# EAGLE design Serial_CAN_Bus_V1.3 (EAGLE 6.4)
DESCRIPTION: microOBD 200 OBD-II Module; HW_REV: 1.4; PCB_REV: C; PCB_SPEC1: Layer Count: 4; PCB_SPEC2: Size: 1.3" x 0.59"; PCB_SPEC3: Finish Thickness: 0.049" - 0.052"; PCB_SPEC4: Copper Weight: 1oz; TITLE: STM1120

## Sheet 1 of 2
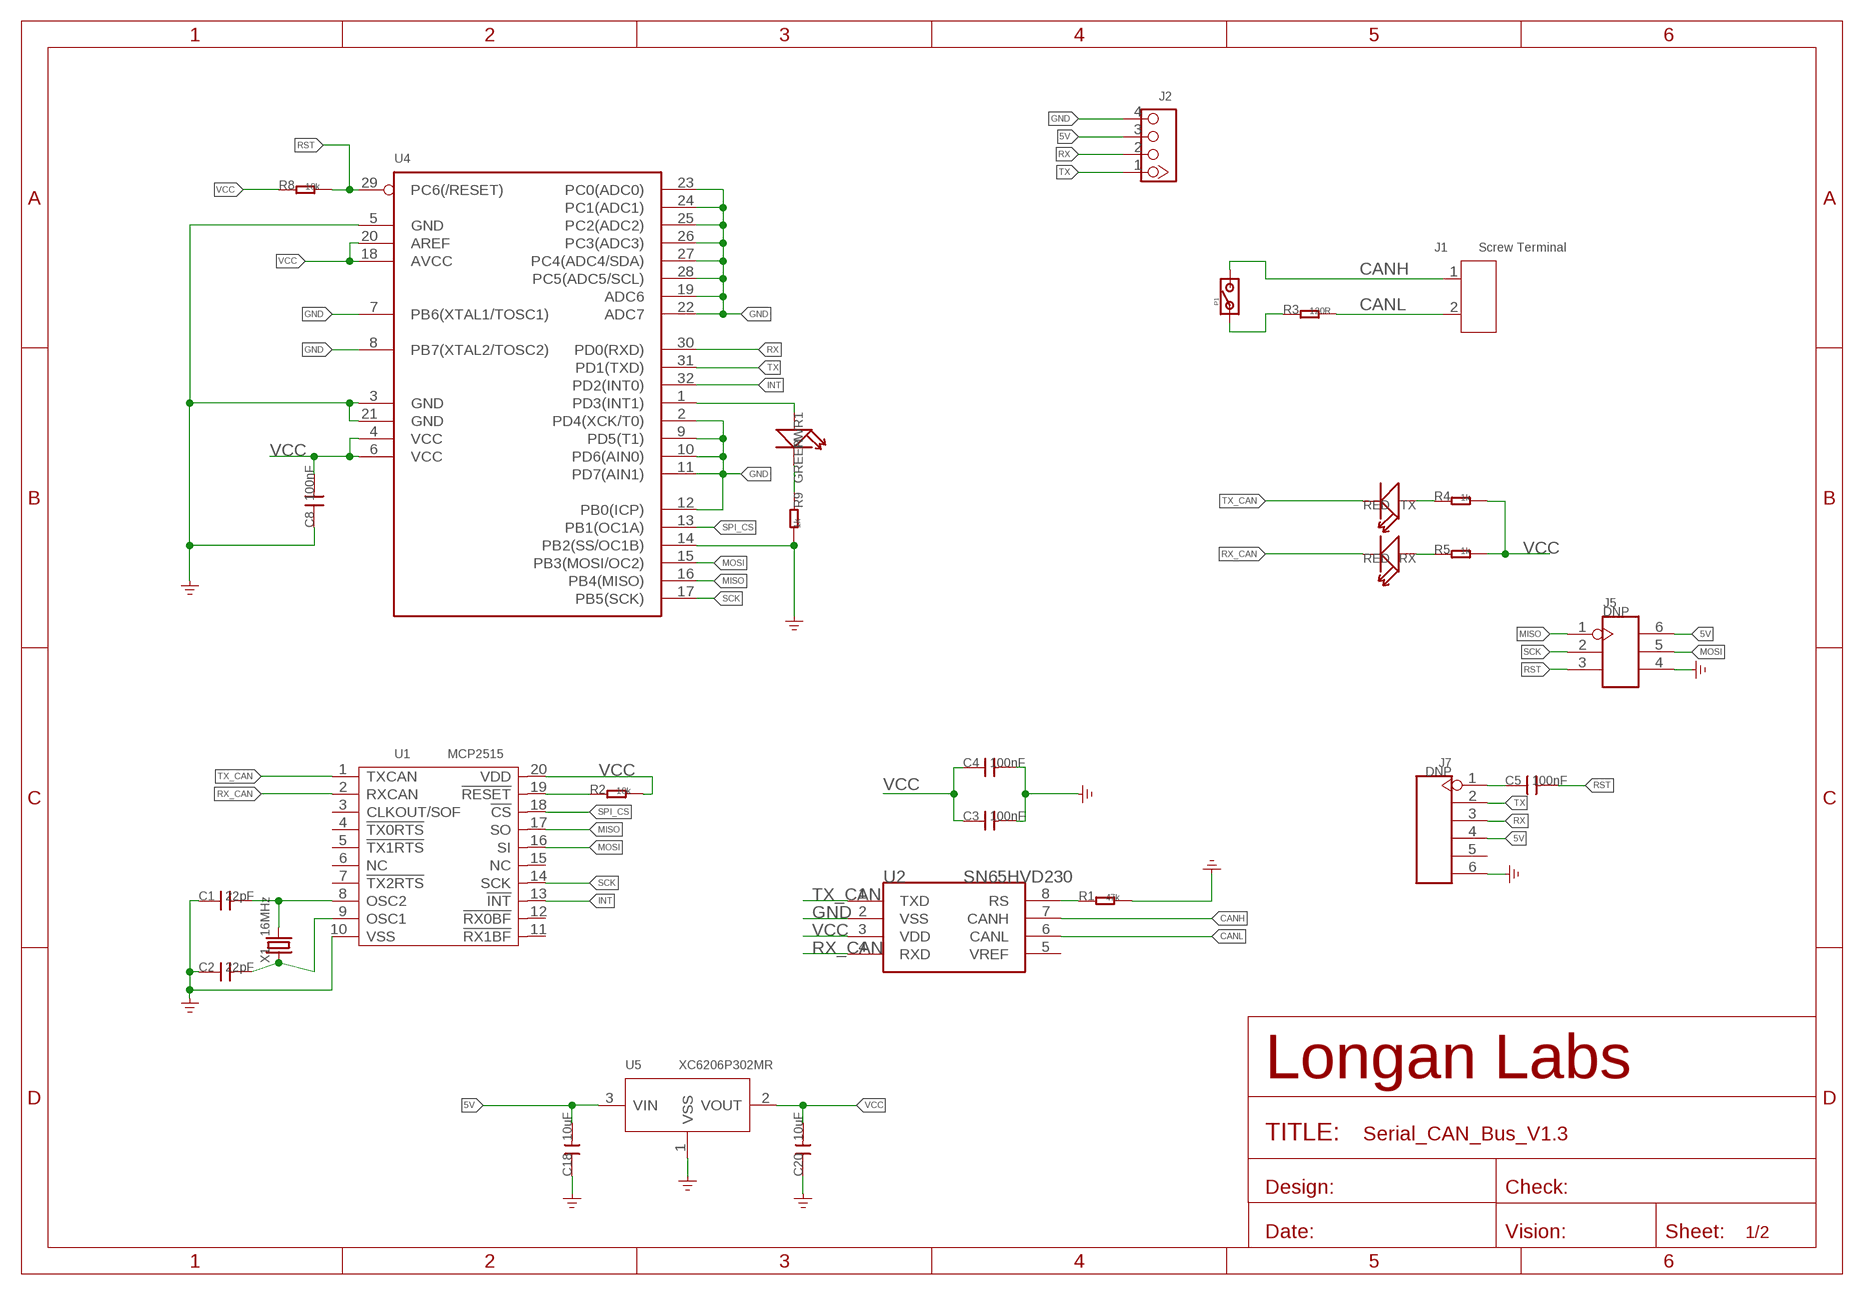
[diagram p0: schematic, sheet 1]

### Parts
C1  22pF  C-0603  [0603]
C2  22pF  C-0603  [0603]
C3  100nF  C-0603  [0603]
C4  100nF  C-0603  [0603]
C5  100nF  C-0603  [0603]
C8  100nF  C-0603  [0603]
C18  10uF  CAP-0603  [C0603]
C20  10uF  CAP-0603  [C0603]
J1  Screw Terminal  SCREW-TERMINAL-2P'3.5'  [2P-3.5]
J2  320110033  GROVE-CONNECTOR-DIP-2.0  [HW4-2.0]
J5  DNP  HEADER-2X3P-2.0-1.143  [H2X3-SMD-2.0(1.143)]
J7  DNP  HEADER-6P-55/35MIL  [H6-2.54]
P1  PAD-JUMPER-2P  [2P-SMD-1.78X1.27]
PWR1  GREEN  LED'0603'  [LED-0603]
R1  47k  R-0603  [0603]
R2  10k  R-0603  [0603]
R3  120R  R-0603  [0603]
R4  1k  R-0603  [0603]
R5  1k  R-0603  [0603]
R8  10k  R-0603  [0603]
R9  1k  R-0603  [0603]
RX  RED  LED'0603'  [LED-0603]
TX  RED  LED'0603'  [LED-0603]
U1  MCP2515  MCP2515'ST'  [TSSOP20-0.65-6.5X4.4MM]
U2  SN65HVD230  MCP2551-SOIC8  [SOIC8-6.0]
U4  MCU-ATMEGA8/168/328'AU'  [TQFP32-0.8-7X7MM]
U5  XC6206P302MR  PMIC-XC6206PMR  [SOT-23]
X1  16MHz  CRYSTAL-2P'HC49US'  [HC49US]

### Nets
5V: C18.2 J2.3 J5.6 J7.4 U5.3(VIN)
CANH: J1.1 P1.2 U2.7(CANH)
CANL: J1.2 R3.2 U2.6(CANL)
GND: C1.1 C2.1 C3.2 C4.2 C8.1 C18.1 C20.1 J2.4 J5.4 J7.6 R1.2 R9.2 U1.10(VSS) U2.2(VSS) U4.2(PD4(XCK/T0)) U4.3(GND) U4.5(GND) U4.7(PB6(XTAL1/TOSC1)) U4.8(PB7(XTAL2/TOSC2)) U4.9(PD5(T1)) U4.10(PD6(AIN0)) U4.11(PD7(AIN1)) U4.12(PB0(ICP)) U4.14(PB2(SS/OC1B)) U4.19(ADC6) U4.21(GND) U4.22(ADC7) U4.23(PC0(ADC0)) U4.24(PC1(ADC1)) U4.25(PC2(ADC2)) U4.26(PC3(ADC3)) U4.27(PC4(ADC4/SDA)) U4.28(PC5(ADC5/SCL)) U5.1(VSS) ; supply symbol labelled GND_POWER
INT: U1.13(!INT) U4.32(PD2(INT0))
MISO: J5.1 U1.17(SO) U4.16(PB4(MISO))
MOSI: J5.5 U1.16(SI) U4.15(PB3(MOSI/OC2))
N$1: P1.1 R3.1
N$2: R4.1 TX.+
N$5: C5.1 J7.1
N$6: PWR1.+ U4.1(PD3(INT1))
N$7: PWR1.- R9.1
N$15: R5.1 RX.+
N$16: C1.2 U1.8(OSC2) X1.2
N$17: C2.2 U1.9(OSC1) X1.1
N$20: R1.1 U2.8(RS)
RST: C5.2 J5.3 R8.2 U4.29(PC6(/RESET))
RST_N: R2.1 U1.19(!RESET)
RX: J2.2 J7.3 U4.30(PD0(RXD))
RX_CAN: RX.- U1.2(RXCAN) U2.4(RXD)
SCK: J5.2 U1.14(SCK) U4.17(PB5(SCK))
SPI_CS: U1.18(!CS) U4.13(PB1(OC1A))
TX: J2.1 J7.2 U4.31(PD1(TXD))
TX_CAN: TX.- U1.1(TXCAN) U2.1(TXD)
VCC: C3.1 C4.1 C8.2 C20.2 R2.2 R4.2 R5.2 R8.1 U1.20(VDD) U2.3(VDD) U4.4(VCC) U4.6(VCC) U4.18(AVCC) U4.20(AREF) U5.2(VOUT)
Unconnected: J7.5 U1.3(CLKOUT/SOF) U1.4(!TX0RTS) U1.5(!TX1RTS) U1.6(NC) U1.7(!TX2RTS) U1.11(!RX1BF) U1.12(!RX0BF) U1.15(NC) U2.5(VREF)

## Sheet 2 of 2

## Library data of the parts
C1-C5 C8 = Discrete:C*: Ceramic Capacitors
C18 C20 = Discrete-new:CAP: Ceramic Capacitors
J1 = Connector-new:SCREW-TERMINAL-2P: 2P-3.5:320110028;2P-5.0:320110031
J2 = Connector-new:GROVE-CONNECTOR-DIP: 4P-2.0:320110033;4P-2.0-90D:320110034
J5 = Connector-new:HEADER-2X3P
J7 = Connector-new:HEADER-6P
P1 = Discrete:PAD-JUMPER-2P
PWR1 RX TX = Discrete:LED*
R1-R5 R8 R9 = Discrete:R*
U1 = Heilight:MCP2515
U2 = IC:MCP2551: High-Speed CAN Transceiver http://ww1.microchip.com/downloads/en/devicedoc/21667f.pdf
U4 = IC-new:MCU-ATMEGA8/168/328
U5 = IC-new:PMIC-XC6206P: LOW ESR Cap.Compatible Positive Voltage Regulators
X1 = Discrete-new:CRYSTAL-2P

## Net classes
3 usbvcc: width 0.152 mm, drill 0.152 mm, clearance 0.152 mm

## Board
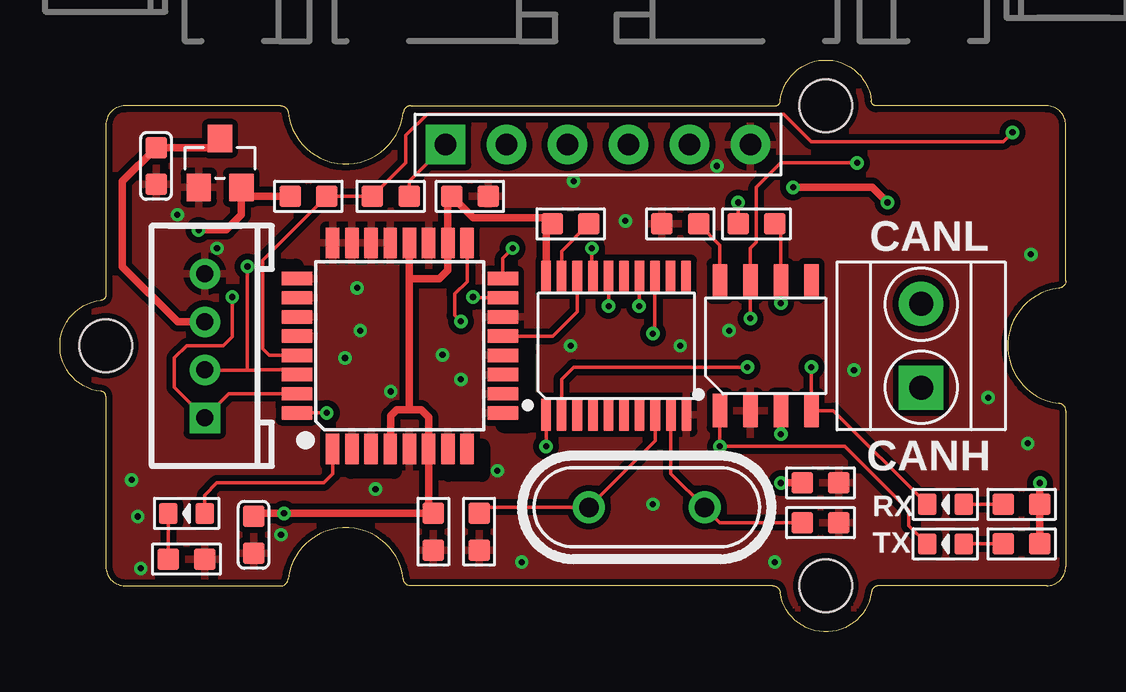
[diagram p1: board, top side]
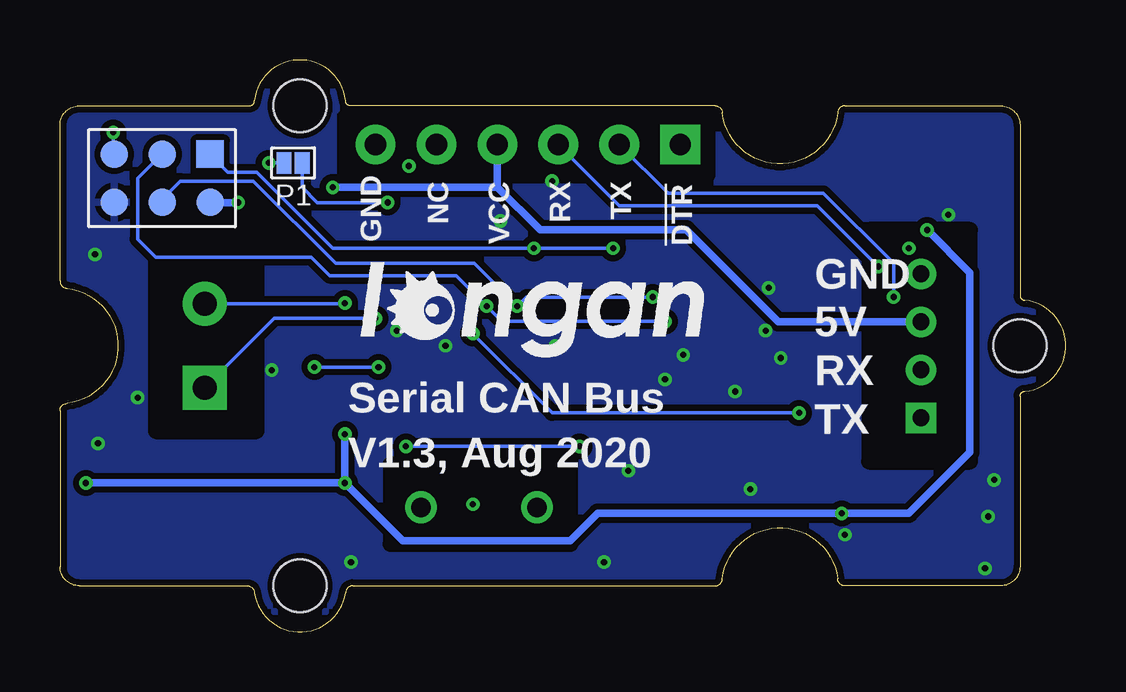
[diagram p2: board, bottom side, seen from below]

Size 41.91 x 23.83 mm. Coordinates in mm from the lower left corner, seen from the top.
Copper layers (1*16): Top 0.035mm / dielectric 1.5mm / Bottom 0.035mm
Design rules "SeeedStudio_2layer_DRU_no_angle_20140221 *": minimum track width 6mil, minimum drill 10mil, track to track 6mil, track to pad 6mil, pad to pad 6mil, via to via 6mil, smd to smd 0mil, copper to edge 10mil, drill to drill 10mil, minimum pad ring 10mil, minimum via ring 6mil, stop-mask expansion 2mil, vias tented up to drill 25mil, thermal gap 10mil
tRestrict: area 9.2,12.3 to 9.8,15.2; area 18.5,8.6 to 19.5,11.7; area 16.2,6.6 to 17.6,7.7; area 12.1,6.7 to 13.9,7.6
bRestrict: area 4,7.1 to 8.2,16.7; area 33.7,8.4 to 37.9,15.4; area 20.6,3.7 to 28.1,7; area 14.9,19 to 30,21.4

### Footprints (pad centres in the part's own frame; a part is rotated, then mirrored left to right if it is on the bottom)
0603 = smd 0.889 x 0.889: 1 -0.762,0; 2 0.762,0
C0603 = smd 0.889 x 0.889: 1 -0.762,0; 2 0.762,0
2P-3.5 = drill 1 pad 1.85 square: 1 -1.75,0 | drill 1 pad 1.85: 2 1.75,0
HW4-2.0 = drill 0.7 pad 1.27 square: 1 -3,0 | drill 0.7 pad 1.27: 2 -1,0; 3 1,0; 4 3,0
H2X3-SMD-2.0(1.143) = smd 1.143 x 1.143: 1 -1,2; 2 -1,0; 3 -1,-2; 4 1,-2; 5 1,0; 6 1,2
H6-2.54 = drill 0.889 pad 1.651 square: 1 0,6.35 | drill 0.889 pad 1.651: 2 0,3.81; 3 0,1.27; 4 0,-1.27; 5 0,-3.81; 6 0,-6.35
2P-SMD-1.78X1.27 = smd 0.889 x 0.61: 1 0,0.381; 2 0,-0.381
LED-0603 = smd 0.762 x 0.889: + -0.762,0; - 0.762,0
TSSOP20-0.65-6.5X4.4MM = smd 0.4 x 1.35: 1 -2.925,-2.875; 2 -2.275,-2.875; 3 -1.625,-2.875; 4 -0.975,-2.875; 5 -0.325,-2.875; 6 0.325,-2.875; 7 0.975,-2.875; 8 1.625,-2.875; 9 2.275,-2.875; 10 2.925,-2.875; 11 2.91,2.875; 12 2.26,2.875; 13 1.61,2.875; 14 0.96,2.875; 15 0.325,2.875; 16 -0.325,2.875; 17 -0.975,2.875; 18 -1.625,2.875; 19 -2.275,2.875; 20 -2.925,2.875
SOIC8-6.0 = smd 0.6 x 1.4: 1 -1.905,-2.7; 2 -0.635,-2.7; 3 0.635,-2.7; 4 1.905,-2.7; 5 1.905,2.7; 6 0.635,2.7; 7 -0.635,2.7; 8 -1.905,2.7
GROVE-TEST-PLATFORM = hole 2.2: -10,-10; -10,10; 20,0
TQFP32-0.8-7X7MM = smd 1.27 x 0.559: 1 -4.293,2.8; 2 -4.293,2; 3 -4.293,1.2; 4 -4.293,0.4; 5 -4.293,-0.4; 6 -4.293,-1.2; 7 -4.293,-2; 8 -4.293,-2.8; 17 4.293,-2.8; 18 4.293,-2; 19 4.293,-1.2; 20 4.293,-0.4; 21 4.293,0.4; 22 4.293,1.2; 23 4.293,2; 24 4.293,2.8 | smd 0.559 x 1.27: 9 -2.8,-4.293; 10 -2,-4.293; 11 -1.2,-4.293; 12 -0.4,-4.293; 13 0.4,-4.293; 14 1.2,-4.293; 15 2,-4.293; 16 2.8,-4.293; 25 2.8,4.293; 26 2,4.293; 27 1.2,4.293; 28 0.4,4.293; 29 -0.4,4.293; 30 -1.2,4.293; 31 -2,4.293; 32 -2.8,4.293
SOT-23 = smd 1.016 x 1.143: 1 -0.889,-1.016; 2 0.889,-1.016; 3 0,1.016
HC49US = drill 0.813: 1 -2.413,0; 2 2.413,0

### Placement (x,y rotation side)
C1  17.46,4.17 90 top
C2  31.69,4.56 180 top
C3  31.69,6.21 0 top
C4  17.08,18.14 0 top
C5  13.78,18.14 180 top
C8  15.56,4.17 90 top
C18  4,19.41 90 top
C20  8.07,4.05 90 top
J1  35.88,11.92 90 top
J2  6.03,11.92 90 top
J5  37.66,18.91 270 bottom
J7  22.42,20.3 90 top
P1  32.2,19.54 270 bottom
PWR1  5.27,4.94 180 top
R1  25.85,17 180 top
R2  21.27,17 180 top
R3  29.02,17 0 top
R4  40.07,3.67 0 top
R5  40.07,5.32 0 top
R8  10.35,18.14 0 top
R9  5.27,3.03 0 top
RX  36.89,5.32 180 top
TX  36.89,3.67 180 top
U1  23.18,11.92 0 top
U2  29.4,11.92 0 top
U3  [GROVE-TEST-PLATFORM]  21.91,11.92 180 top
U4  14.16,11.92 90 top
U5  6.67,19.54 0 top
U$5  [LONGAN-SILK-SMALLER]  30.67,10.27 0 bottom
X1  24.45,5.19 180 top

### Tracks (layer width: path | path; a pad name or v marks a point on that pad's centre or on a via)
5V  (via drill 0.25 pad 0.51)
  Top 0.305: U5.3 6.29,20.18 C18.2 2.6,18.78 2.6,15.22 4.91,12.92 J2.3 | v30.54,18.53 33.85,18.53 v34.48,17.89
  Bottom 0.305: J2.3 11.99,12.92 15.81,16.75 21.91,16.75 23.69,18.53 | 23.69,18.53 J7.4 | 23.69,18.53 v30.54,18.53 | v34.48,17.89 35.64,17.89 J5.6
CANH  (via drill 0.25 pad 0.51)
  Top 0.152: v28.77,13.06 U2.7 28.77,15.99 29.02,16.24 29.02,18.53 30.04,19.54 v33.21,19.54
  Bottom 0.152: v28.77,13.06 32.99,13.06 J1.1 | v33.21,19.54 P1.2
CANL  (via drill 0.25 pad 0.51)
  Top 0.152: v30.04,13.7 U2.6 30.04,16.75 R3.2
  Bottom 0.152: J1.2 30.06,13.67 v30.04,13.7
GND  (via drill 0.25 pad 0.51)
  other vias: 12.51,12.56 16.7,10.52 25.85,11.92 27.88,12.56 33.08,10.91 40.32,7.86 40.45,15.73 21.4,18.78 27.37,19.41 13.78,10.02 3.24,4.81 9.21,4.05 19.24,2.9 24.7,5.32 29.78,2.9 12.38,14.33 15.94,11.54 11.88,11.41 2.99,6.33 3.37,2.65 13.15,5.95 18.23,6.71 38.67,9.76 23.56,17.13 21.27,11.92 4.89,17.38 6.54,15.99
  pour Bottom (isolate 0.254): -0.32,-0.14 42.23,-0.14 42.23,23.99 -0.32,23.99
  pour Top (isolate 0.254): -0.32,-0.14 42.23,-0.14 42.23,23.99 -0.32,23.99
INT  (via drill 0.25 pad 0.51)
  Top 0.152: U4.32 v11.11,9.12 v11.11,9.13 | U1.13 24.79,12.52 v24.7,12.43
  Bottom 0.152: v11.11,9.13 21.4,9.13 v24.7,12.43
MISO  (via drill 0.25 pad 0.51)
  Top 0.152: U4.16 18.45,15.58 v18.86,15.99 | v22.16,15.99 22.16,14.84 U1.17
  Bottom 0.152: v18.86,15.99 v22.16,15.99 30.54,15.99 33.72,19.16 34.91,19.16 J5.1
MOSI  (via drill 0.25 pad 0.51)
  Top 0.152: U4.15 17.24,13.92 v17.21,13.95 | v22.86,13.57 22.86,14.79 U1.16
  Bottom 0.152: v17.21,13.95 22.48,13.95 v22.86,13.57 24.64,15.35 30.42,15.35 33.85,18.78 36.89,18.78 37.66,18.02 J5.5
N$1  (via drill 0.25 pad 0.51)
  Top 0.152: R3.1 v28.26,17.89
  Bottom 0.152: v28.26,17.89 31.18,17.89 31.81,18.53 P1.1
N$2
  Top 0.152: TX.+ R4.1
N$5
  Top 0.152: C5.1 14.54,18.78 J7.1
N$6
  Top 0.152: PWR1.+ 6.03,5.7 6.54,6.21 10.99,6.21 11.37,6.59 U4.1
N$7
  Top 0.152: PWR1.- R9.1
N$15
  Top 0.152: RX.+ R5.1
N$16
  Top 0.152: U1.8 24.8,7.96 X1.2 17.72,5.19 C1.2
N$17
  Top 0.152: U1.9 25.45,6.6 X1.1 27.5,4.56 C2.2
N$20
  Top 0.152: U2.8 27.5,16.11 R1.1
RST  (via drill 0.25 pad 0.51)
  Top 0.152: U4.29 8.72,11.52 8.45,11.79 8.45,15.48 R8.2 C5.2 14.42,19.54 14.42,20.68 15.3,21.57 30.16,21.57 31.31,20.43 39.31,20.43 v39.69,20.81
  Bottom 0.152: v39.69,20.81 39.69,19.94 J5.3
RST_N
  Top 0.152: U1.19 20.9,15.87 R2.1
RX  (via drill 0.25 pad 0.51)
  Top 0.152: U4.30 9.67,10.92 8.34,10.92 8.32,10.91 7.81,10.91 | 7.81,10.91 6.05,10.91 J2.2 | v7.81,15.22 7.81,10.91
  Bottom 0.152: J7.3 18.61,17.76 10.35,17.76 v7.81,15.22
RX_CAN  (via drill 0.25 pad 0.51)
  Top 0.152: U1.2 20.9,10.54 21.4,11.03 v28.64,11.03 | RX.- 32.23,9.22 U2.4 v31.31,11.03
  Bottom 0.152: v28.64,11.03 v31.31,11.03
SCK  (via drill 0.25 pad 0.51)
  Top 0.152: U4.17 16.96,14.59 16.45,14.08 16.45,13.19 v16.7,12.94 | v24.13,13.57 24.13,14.79 U1.14
  Bottom 0.152: v16.7,12.94 23.5,12.94 v24.13,13.57 25.4,14.84 30.67,14.84 31.43,15.6 37.91,15.6 38.67,16.37 38.67,18.91 37.67,19.91 J5.2
SPI_CS
  Top 0.152: U4.13 20.53,12.32 21.55,13.34 U1.18
TX  (via drill 0.25 pad 0.51)
  Top 0.152: v7.18,13.95 7.18,12.3 6.8,11.92 5.27,11.92 4.76,11.41 4.76,10.19 J2.1 7.03,9.92 U4.31
  Bottom 0.152: J7.2 16.57,18.27 10.1,18.27 7.18,15.35 v7.18,13.95
TX_CAN  (via drill 0.25 pad 0.51)
  Top 0.152: U1.1 v20.25,7.73 v20.26,7.73 | U2.1 v27.5,7.73 32.7,7.73 35.37,5.06 35.37,4.43 TX.-
  Bottom 0.152: v20.26,7.73 v27.5,7.73
VCC  (via drill 0.25 pad 0.51)
  Top 0.305: R4.2 R5.2 v40.83,6.21 | 14.54,9.25 15.05,9.25 15.36,8.94 U4.6 15.36,5.13 C8.2 v9.34,4.94 8.19,4.94 C20.2 | 14.54,9.25 14.03,9.25 13.78,9 13.78,7.65 U4.4 | U4.20 14.56,14.72 | 14.56,14.72 14.56,9.27 14.54,9.25 | 14.56,14.72 15.81,14.72 16.16,15.06 U4.18 16.16,17.99 C4.1 17.21,17.26 20.26,17.26 R2.2 | R2.2 20.51,17.13 | C3.1 v30.04,6.21 | v30.04,8.24 U2.3 | U1.20 20.25,16.74 R2.2 | R8.1 7.94,18.14 U5.2 7.56,17.38 6.92,16.75 v5.78,16.75
  Bottom 0.305: v30.04,6.21 v30.04,8.24 | v40.83,6.21 v30.04,6.21 | v30.04,6.21 27.62,3.79 20.64,3.79 19.5,4.94 v9.34,4.94 6.54,4.94 4,7.48 4,14.97 v5.78,16.75

### Text on the board
tPlace: CANL | CANH | RX | TX
bPlace: !DTR | TX | RX | VCC | NC | GND | P1 | GND | 5V | RX | Serial CAN Bus | TX | V1.3, Aug 2020
tValues: 168